# Altium schematic sheet MCU.SchDoc
size A4; SheetNumber: 1; SheetTotal: 1
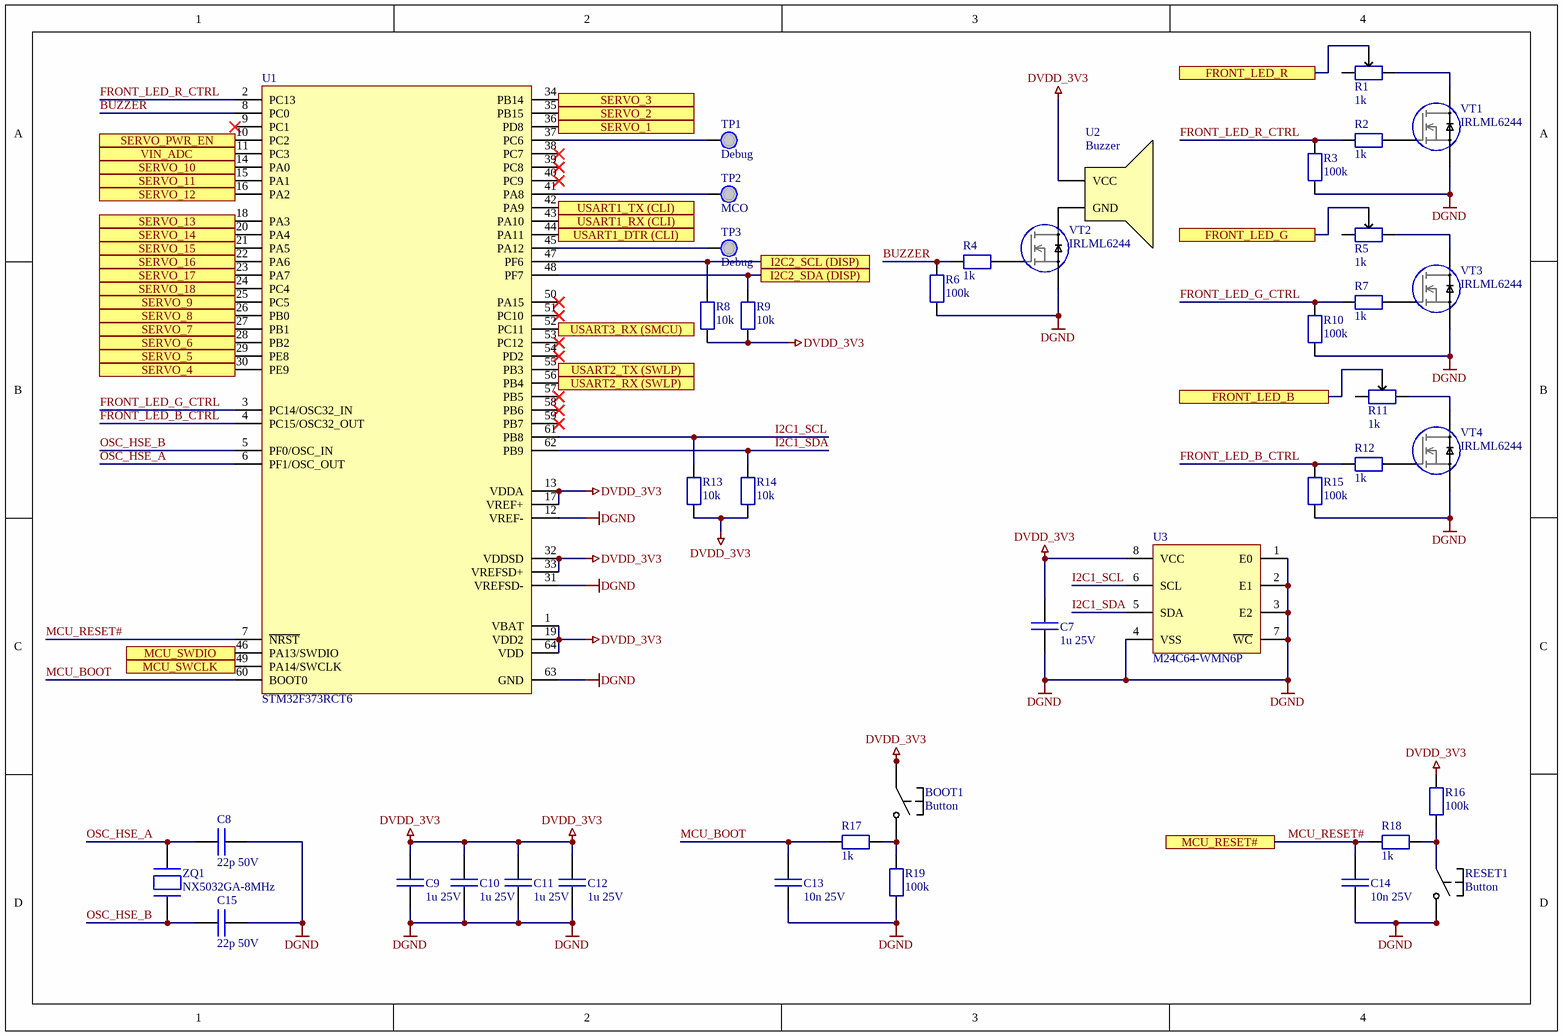
[diagram p0: MCU.SchDoc]

## Parts
BOOT1  Button  [BUTTON_SMD_3x6]
C7  1u 25V  [C_0603/1608]
C8  22p 50V  [C_0603/1608]
C9  1u 25V  [C_0603/1608]
C10  1u 25V  [C_0603/1608]
C11  1u 25V  [C_0603/1608]
C12  1u 25V  [C_0603/1608]
C13  10n 25V  [C_0603/1608]
C14  10n 25V  [C_0603/1608]
C15  22p 50V  [C_0603/1608]
R1  1k  [R_VAR_3.2x3.2_SMD]
R2  1k  [R_0603/1608]
R3  100k  [R_0603/1608]
R4  1k  [R_0603/1608]
R5  1k  [R_VAR_3.2x3.2_SMD]
R6  100k  [R_0603/1608]
R7  1k  [R_0603/1608]
R8  10k  [R_0603/1608]
R9  10k  [R_0603/1608]
R10  100k  [R_0603/1608]
R11  1k  [R_VAR_3.2x3.2_SMD]
R12  1k  [R_0603/1608]
R13  10k  [R_0603/1608]
R14  10k  [R_0603/1608]
R15  100k  [R_0603/1608]
R16  100k  [R_0603/1608]
R17  1k  [R_0603/1608]
R18  1k  [R_0603/1608]
R19  100k  [R_0603/1608]
RESET1  Button  [BUTTON_SMD_3x6]
TP1  Debug  [TP_SMD_D1.00]  (no BOM)
TP2  MCO  [TP_SMD_D1.00]  (no BOM)
TP3  Debug  [TP_SMD_D1.00]  (no BOM)
U1  STM32F373RCT6  [LQFP64]
U2  Buzzer  [PLS-2R 2.54]
U3  M24C64-WMN6P  [SO8_1.27]
VT1  IRLML6244  [SOT23-3]
VT2  IRLML6244  [SOT23-3]
VT3  IRLML6244  [SOT23-3]
VT4  IRLML6244  [SOT23-3]
ZQ1  NX5032GA-8MHz  [OSC_2PINS SMD]

## Ports
FRONT_LED_B, FRONT_LED_G, FRONT_LED_R, I2C2_SCL (DISP), I2C2_SDA (DISP), MCU_RESET#, MCU_SWCLK, MCU_SWDIO, SERVO_1, SERVO_2, SERVO_3, SERVO_4, SERVO_5, SERVO_6, SERVO_7, SERVO_8, SERVO_9, SERVO_10, SERVO_11, SERVO_12, SERVO_13, SERVO_14, SERVO_15, SERVO_16, SERVO_17, SERVO_18, SERVO_PWR_EN, USART1_DTR (CLI), USART1_RX (CLI), USART1_TX (CLI), USART2_RX (SWLP), USART2_TX (SWLP), USART3_RX (SMCU), VIN_ADC

## Nets
DGND: C7.1 C8.2 C9.2 C10.2 C11.2 C12.2 C13.2 C14.2 C15.2 R3.1 R6.1 R10.1 R15.1 R19.2 RESET1.2 RESET1.4 U1.12(VREF-) U1.31(VREFSD-) U1.63(GND) U3.1(E0) U3.2(E1) U3.3(E2) U3.4(VSS) U3.7(~{WC}) VT1.S VT2.S VT3.S VT4.S
DVDD_3V3: BOOT1.1 BOOT1.3 C7.2 C9.1 C10.1 C11.1 C12.1 R8.1 R9.1 R13.1 R14.1 R16.1 U1.1(VBAT) U1.13(VDDA) U1.17(VREF+) U1.19(VDD2) U1.32(VDDSD) U1.33(VREFSD+) U1.64(VDD) U2.2(VCC) U3.8(VCC)
BUZZER: R4.2 R6.2 U1.8(PC0)
FRONT_LED_B: R11.2 ; port FRONT_LED_B
FRONT_LED_B_CTRL: R12.2 R15.2 U1.4(PC15/OSC32_OUT)
FRONT_LED_G: R5.2 ; port FRONT_LED_G
FRONT_LED_G_CTRL: R7.2 R10.2 U1.3(PC14/OSC32_IN)
FRONT_LED_R: R1.2 ; port FRONT_LED_R
FRONT_LED_R_CTRL: R2.2 R3.2 U1.2(PC13)
I2C1_SCL: R13.2 U1.61(PB8) U3.6(SCL)
I2C1_SDA: R14.2 U1.62(PB9) U3.5(SDA)
I2C2_SCL (DISP): R8.2 U1.47(PF6) ; port I2C2_SCL (DISP)
I2C2_SDA (DISP): R9.2 U1.48(PF7) ; port I2C2_SDA (DISP)
MCU_BOOT: C13.1 R17.2 U1.60(BOOT0)
MCU_RESET#: C14.1 R18.2 U1.7(~{NRST}) ; port MCU_RESET#
MCU_SWCLK: U1.49(PA14/SWCLK) ; port MCU_SWCLK
MCU_SWDIO: U1.46(PA13/SWDIO) ; port MCU_SWDIO
OSC_HSE_A: C8.1 U1.6(PF1/OSC_OUT) ZQ1.2
OSC_HSE_B: C15.1 U1.5(PF0/OSC_IN) ZQ1.1
SERVO_1: U1.36(PD8) ; port SERVO_1
SERVO_2: U1.35(PB15) ; port SERVO_2
SERVO_3: U1.34(PB14) ; port SERVO_3
SERVO_4: U1.30(PE9) ; port SERVO_4
SERVO_5: U1.29(PE8) ; port SERVO_5
SERVO_6: U1.28(PB2) ; port SERVO_6
SERVO_7: U1.27(PB1) ; port SERVO_7
SERVO_8: U1.26(PB0) ; port SERVO_8
SERVO_9: U1.25(PC5) ; port SERVO_9
SERVO_10: U1.14(PA0) ; port SERVO_10
SERVO_11: U1.15(PA1) ; port SERVO_11
SERVO_12: U1.16(PA2) ; port SERVO_12
SERVO_13: U1.18(PA3) ; port SERVO_13
SERVO_14: U1.20(PA4) ; port SERVO_14
SERVO_15: U1.21(PA5) ; port SERVO_15
SERVO_16: U1.22(PA6) ; port SERVO_16
SERVO_17: U1.23(PA7) ; port SERVO_17
SERVO_18: U1.24(PC4) ; port SERVO_18
SERVO_PWR_EN: U1.10(PC2) ; port SERVO_PWR_EN
USART1_DTR (CLI): U1.44(PA11) ; port USART1_DTR (CLI)
USART1_RX (CLI): U1.43(PA10) ; port USART1_RX (CLI)
USART1_TX (CLI): U1.42(PA9) ; port USART1_TX (CLI)
USART2_RX (SWLP): U1.56(PB4) ; port USART2_RX (SWLP)
USART2_TX (SWLP): U1.55(PB3) ; port USART2_TX (SWLP)
USART3_RX (SMCU): U1.52(PC11) ; port USART3_RX (SMCU)
VIN_ADC: U1.11(PC3) ; port VIN_ADC
NetBOOT1_2: BOOT1.2 BOOT1.4 R17.1 R19.1
NetR1_3: R1.3 VT1.D
NetR2_1: R2.1 VT1.G
NetR4_1: R4.1 VT2.G
NetR5_3: R5.3 VT3.D
NetR7_1: R7.1 VT3.G
NetR11_3: R11.3 VT4.D
NetR12_1: R12.1 VT4.G
NetR16_2: R16.2 R18.1 RESET1.1 RESET1.3
NetTP1_1: TP1.1 U1.37(PC6)
NetTP2_1: TP2.1 U1.41(PA8)
NetTP3_1: TP3.1 U1.45(PA12)
NetU2_1: U2.1(GND) VT2.D

Not connected (* = marked no-connect by the designer): R1 1; R5 1; R11 1; U1 0(EP) 9(PC1)* 38(PC7)* 39(PC8)* 40(PC9)* 50(PA15)* 51(PC10)* 53(PC12)* 54(PD2)* 57(PB5)* 58(PB6)* 59(PB7)*

## Library data of the parts
BOOT1 RESET1 = Button: pin to pad: 3>1 4>2
C7-C15 = Capacitor: Non-polarized capacitor
R1 R5 R11 = Resistor variable
R2-R4 R6-R10 R12-R19 = Resistor
TP1-TP3 = Test point
U1 = STM32F373R: 32-bit Cortex-M3
U3 = I2C EEPROM
VT1-VT4 = MOSFET N: pin to pad: D>3 G>1 S>2
ZQ1 = Crystal oscillator